# Altium schematic sheet gdu460.SchDoc
size A; SheetNumber: 2; SheetTotal: 17
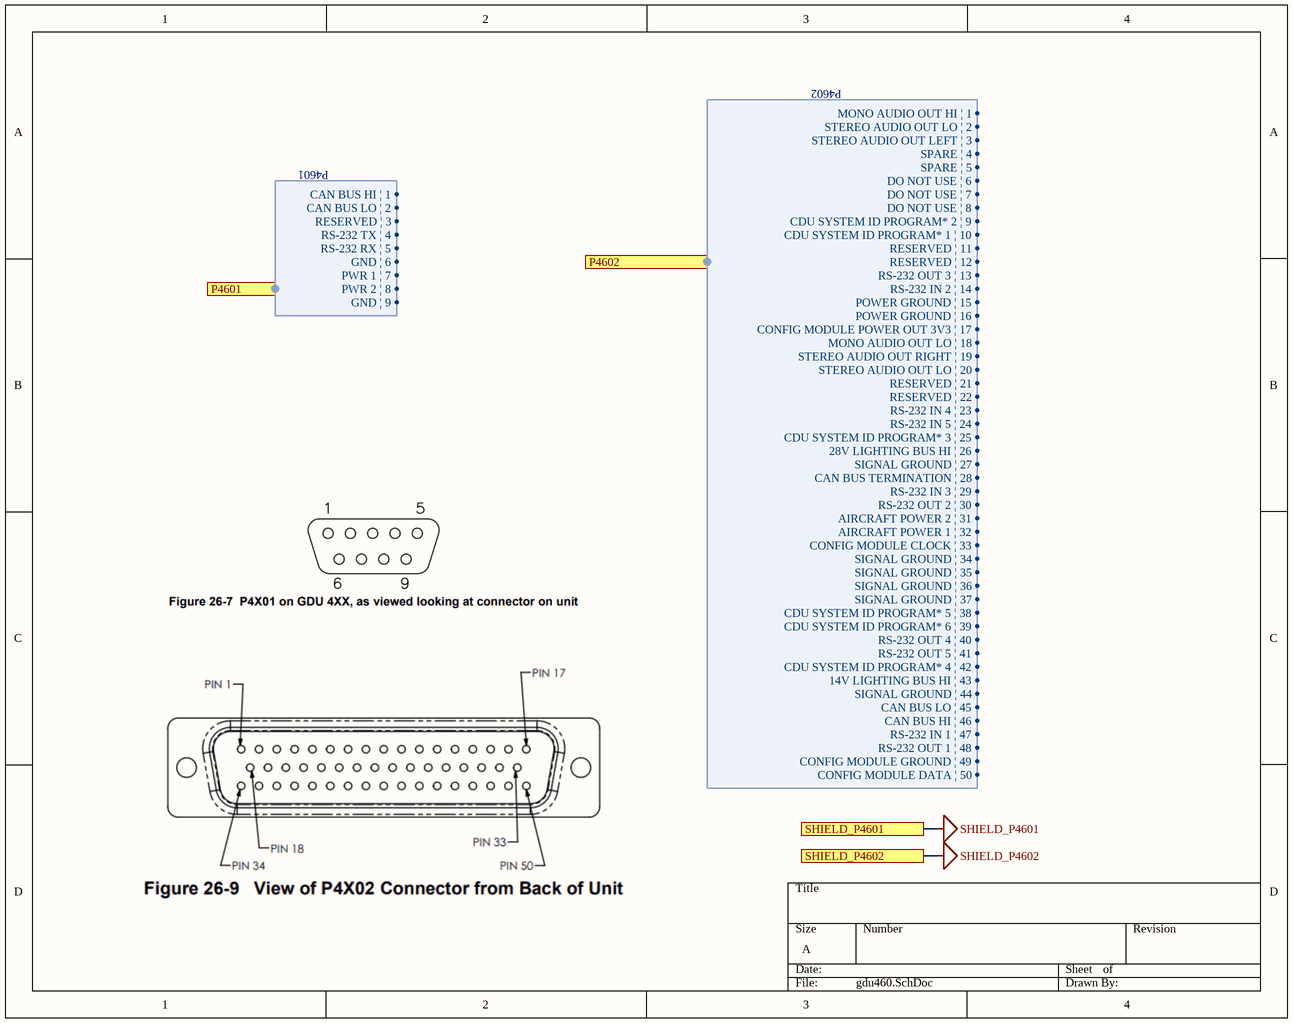
[diagram p0: gdu460.SchDoc]

## Ports
P4601 (harness P4601), P4602 (harness P4602), SHIELD_P4601, SHIELD_P4602

## Harnesses
P4601: CAN BUS HI | 1, CAN BUS LO | 2, RESERVED | 3, RS-232 TX | 4, RS-232 RX | 5, GND | 6, PWR 1 | 7, PWR 2 | 8, GND | 9
P4602: MONO AUDIO OUT HI | 1, STEREO AUDIO OUT LO | 2, STEREO AUDIO OUT LEFT | 3, SPARE | 4, SPARE | 5, DO NOT USE | 6, DO NOT USE | 7, DO NOT USE | 8, CDU SYSTEM ID PROGRAM* 2 | 9, CDU SYSTEM ID PROGRAM* 1 | 10, RESERVED | 11, RESERVED | 12, RS-232 OUT 3 | 13, RS-232 IN 2 | 14, POWER GROUND | 15, POWER GROUND | 16, CONFIG MODULE POWER OUT 3V3 | 17, MONO AUDIO OUT LO | 18, STEREO AUDIO OUT RIGHT | 19, STEREO AUDIO OUT LO | 20, RESERVED | 21, RESERVED | 22, RS-232 IN 4 | 23, RS-232 IN 5 | 24, CDU SYSTEM ID PROGRAM* 3 | 25, 28V LIGHTING BUS HI | 26, SIGNAL GROUND | 27, CAN BUS TERMINATION | 28, RS-232 IN 3 | 29, RS-232 OUT 2 | 30, AIRCRAFT POWER 2 | 31, AIRCRAFT POWER 1 | 32, CONFIG MODULE CLOCK | 33, SIGNAL GROUND | 34, SIGNAL GROUND | 35, SIGNAL GROUND | 36, SIGNAL GROUND | 37, CDU SYSTEM ID PROGRAM* 5 | 38, CDU SYSTEM ID PROGRAM* 6 | 39, RS-232 OUT 4 | 40, RS-232 OUT 5 | 41, CDU SYSTEM ID PROGRAM* 4 | 42, 14V LIGHTING BUS HI | 43, SIGNAL GROUND | 44, CAN BUS LO | 45, CAN BUS HI | 46, RS-232 IN 1 | 47, RS-232 OUT 1 | 48, CONFIG MODULE GROUND | 49, CONFIG MODULE DATA | 50

## Nets
SHIELD_P4601: port SHIELD_P4601
SHIELD_P4602: port SHIELD_P4602